# EAGLE design circuit (EAGLE 7.1.0)
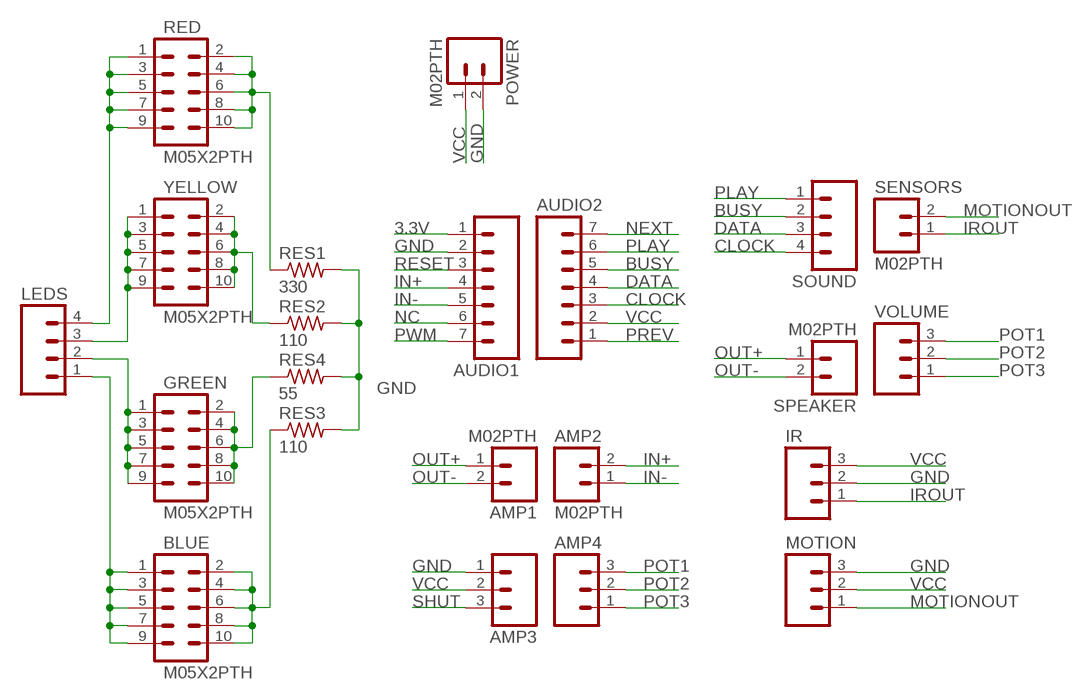
[diagram p0: schematic, sheet 1]

## Parts
AMP1  M02PTH  [1X02]
AMP2  M02PTH  [1X02]
AMP3  M03PTH  [1X03]
AMP4  M03PTH  [1X03]
AUDIO1  M07  [1X07]
AUDIO2  M07  [1X07]
BLUE  M05X2PTH  [AVR_ICSP]
GREEN  M05X2PTH  [AVR_ICSP]
IR  M03PTH  [1X03]
LEDS  M04PTH  [1X04]
MOTION  M03PTH  [1X03]
POWER  M02PTH  [1X02]
RED  M05X2PTH  [AVR_ICSP]
RES1  330  R-US_0204/2V  [0204V]
RES2  110  R-US_0204/2V  [0204V]
RES3  110  R-US_0204/2V  [0204V]
RES4  55  R-US_0204/2V  [0204V]
SENSORS  M02PTH  [1X02]
SOUND  M04PTH  [1X04]
SPEAKER  M02PTH  [1X02]
VOLUME  M03PTH  [1X03]
YELLOW  M05X2PTH  [AVR_ICSP]

## Nets
3.3V: AUDIO1.1
BUSY: AUDIO2.5 SOUND.2
CLOCK: AUDIO2.3 SOUND.4
DATA: AUDIO2.4 SOUND.3
GND: AMP3.1 AUDIO1.2 IR.2 MOTION.3 POWER.2 RES1.2 RES2.2 RES3.2 RES4.2
IN+: AMP2.2 AUDIO1.4
IN-: AMP2.1 AUDIO1.5
IROUT: IR.1 SENSORS.1
MOTIONOUT: MOTION.1 SENSORS.2
N$1: LEDS.4 RED.1 RED.3 RED.5 RED.7 RED.9
N$2: LEDS.3 YELLOW.1 YELLOW.3 YELLOW.5 YELLOW.7 YELLOW.9
N$3: GREEN.1 GREEN.3 GREEN.5 GREEN.7 GREEN.9 LEDS.2
N$4: BLUE.1 BLUE.3 BLUE.5 BLUE.7 BLUE.9 LEDS.1
N$5: RED.2 RED.4 RED.6 RED.8 RED.10 RES1.1
N$6: RES2.1 YELLOW.2 YELLOW.4 YELLOW.6 YELLOW.8 YELLOW.10
N$8: GREEN.2 GREEN.4 GREEN.6 GREEN.8 GREEN.10 RES4.1
N$9: BLUE.2 BLUE.4 BLUE.6 BLUE.8 BLUE.10 RES3.1
NC: AUDIO1.6
NEXT: AUDIO2.7
OUT+: AMP1.1 SPEAKER.1
OUT-: AMP1.2 SPEAKER.2
PLAY: AUDIO2.6 SOUND.1
POT1: AMP4.3 VOLUME.3
POT2: AMP4.2 VOLUME.2
POT3: AMP4.1 VOLUME.1
PREV: AUDIO2.1
PWM: AUDIO1.7
RESET: AUDIO1.3
SHUT: AMP3.3
VCC: AMP3.2 AUDIO2.2 IR.3 MOTION.2 POWER.1

## Library data of the parts
AMP1 AMP2 POWER SENSORS SPEAKER = SparkFun-Connectors:M02: Standard 2-pin 0.1" header. Use with - straight break away headers ( PRT-00116) - right angle break away headers (PRT-00553) - swiss pins (PRT-00743) - machine pins (PRT-00117) - female headers (PRT-00115) Molex polarized connector foot print use with: PRT-08233 with associated crimp pins and housings. 2.54_SCREWTERM for use with PRT-10571. 3.5mm Screw Terminal footprints for PRT-08084 5mm Screw Terminal footprints for use with PRT-08432
AMP3 AMP4 IR MOTION VOLUME = SparkFun-Connectors:M03: Header 3 Standard 3-pin 0.1" header. Use with straight break away headers (SKU : PRT-00116), right angle break away headers (PRT-00553), swiss pins (PRT-00743), machine pins (PRT-00117), and female headers (PRT-00115). Molex polarized connector foot print use with SKU : PRT-08232 with associated crimp pins and housings.
AUDIO1 AUDIO2 = SparkFun-Connectors:M07: Header 7 Standard 7-pin 0.1" header. Use with straight break away headers (SKU : PRT-00116), right angle break away headers (PRT-00553), swiss pins (PRT-00743), machine pins (PRT-00117), and female headers (PRT-00115). NOTES ON THE VARIANTS LOCK and LOCK_LONGPADS... This footprint was designed to help hold the alignment of a through-hole component (i.e. 7-pin header) while soldering it into place. You may notice that each hole has been shifted either up or down by 0.005 of an inch from it's more standard position (which is usually a perfectly straight line). This slight alteration caused the pins (the squares in the middle) to touch the edges of the holes. Because they are alternating, it causes a "brace" to hold the header in place. 0.005 has proven to be the perfect amount of "off-center" position when using our standard breakaway headers. Although looks a little odd when you look at the bare footprint, once you have a header in there, the alteration is very hard to notice. Also, if you push a header all the way into place, it is covered up entirely on the bottom side. This idea of altering the position of holes to aid alignment will be further integrated into the Sparkfun Library for other footprints. It can help hold any component with 3 or more connection pins.
BLUE GREEN RED YELLOW = SparkFun-Connectors:M05X2: Header 5x2 Standard 10-pin dual row 0.1" header. Commonly used with AVR-ISP. Use with Spark Fun Electronics SKU: PRT-00778
LEDS SOUND = SparkFun-Connectors:M04: Header 4 Standard 4-pin 0.1" header. Use with straight break away headers (SKU : PRT-00116), right angle break away headers (PRT-00553), swiss pins (PRT-00743), machine pins (PRT-00117), and female headers (PRT-00115). Molex polarized connector foot print use with SKU : PRT-08231 with associated crimp pins and housings. 1MM SMD Version SKU: PRT-10208
RES1-RES4 = rcl:R-US_: RESISTOR, American symbol

## Board
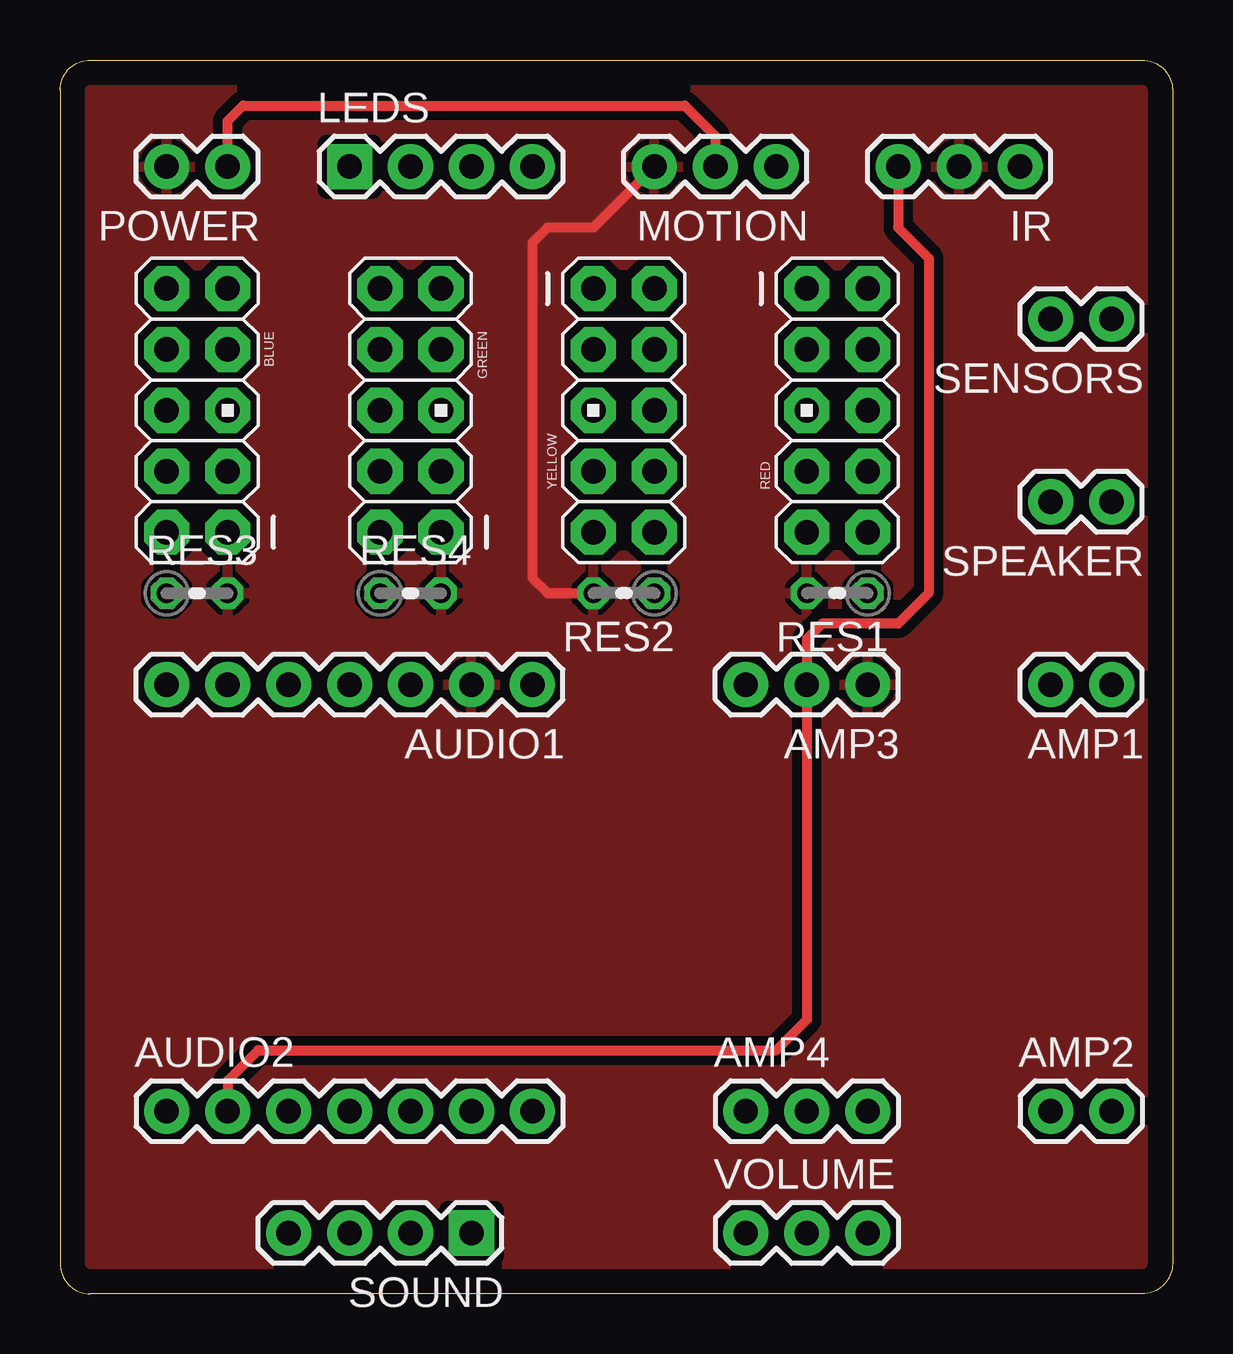
[diagram p1: board, top side]
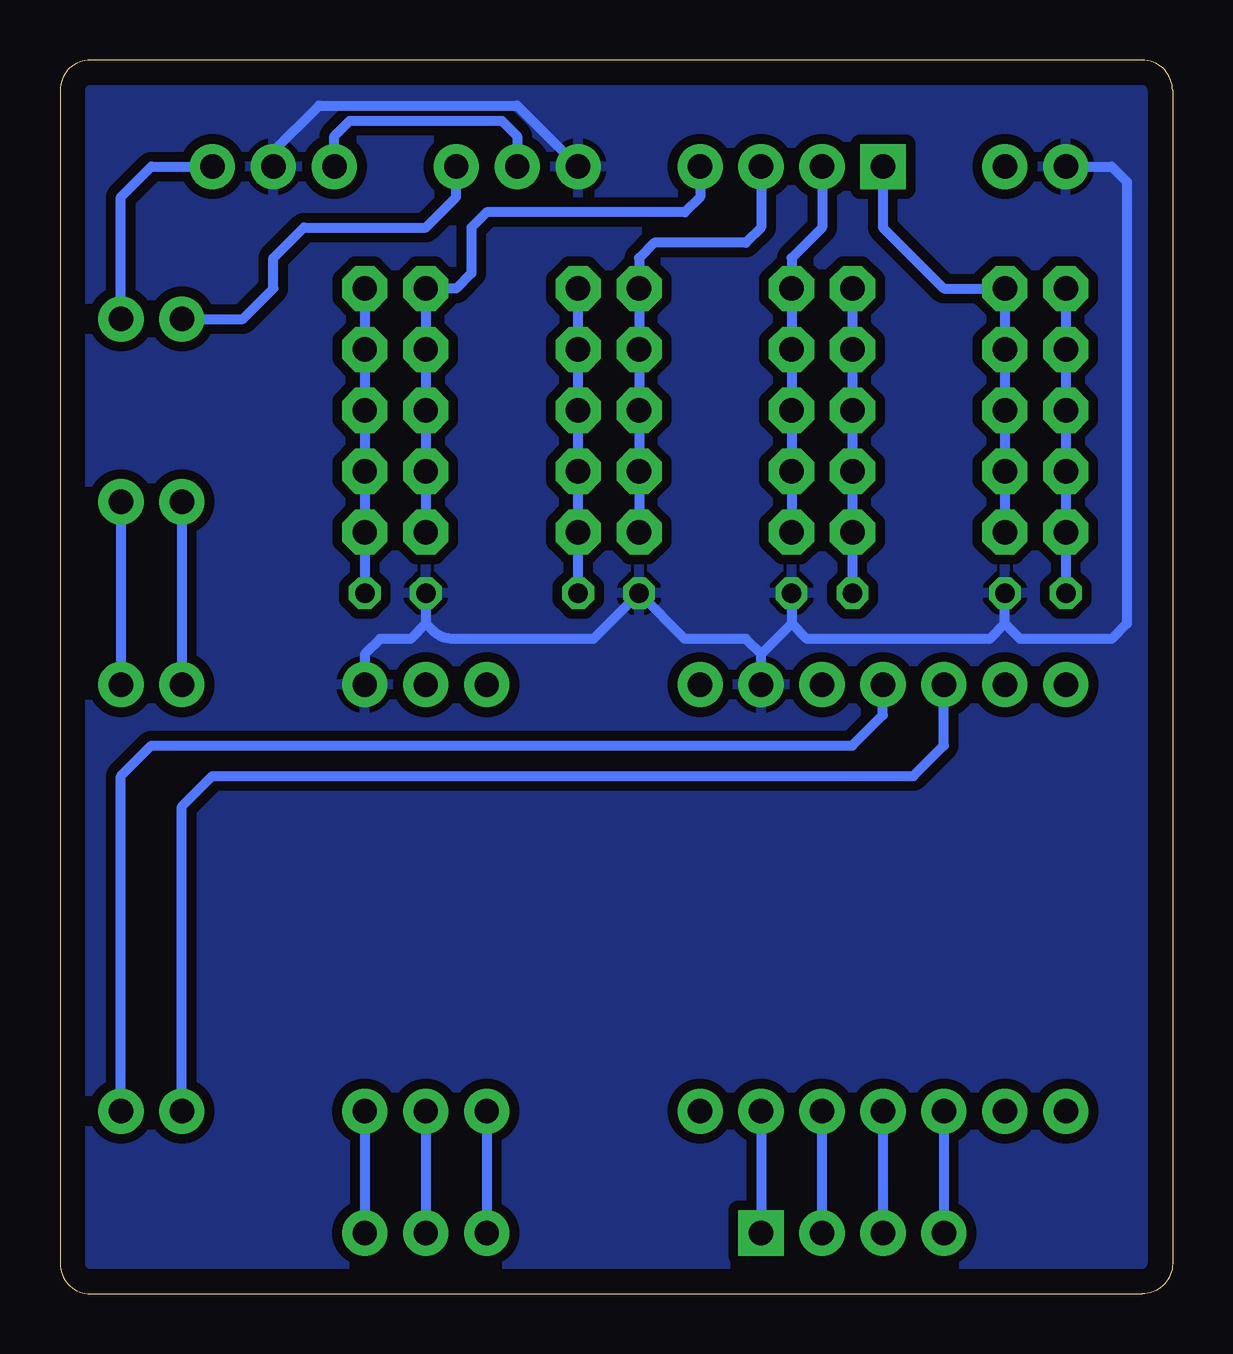
[diagram p2: board, bottom side, seen from below]

Size 46.35 x 51.43 mm. Coordinates in mm from the lower left corner, seen from the top.
Outline: 0,50.16 0,1.27 arc90 1.27,0 45.09,0 arc90 46.35,1.27 46.35,50.16 arc90 45.09,51.43 1.27,51.43 arc90 0,50.16
Copper layers (1*16): Top 0.035mm / dielectric 1.5mm / Bottom 0.035mm
Design rules "default": minimum track width 10mil, minimum drill 24mil, track to track 8mil, track to pad 8mil, pad to pad 8mil, via to via 8mil, smd to smd 8mil, copper to edge 40mil, drill to drill 8mil, minimum pad ring 10mil, minimum via ring 8mil, stop-mask expansion 4mil, vias tented up to drill 0mil, thermal gap 10mil

### Footprints (pad centres in the part's own frame; a part is rotated, then mirrored left to right if it is on the bottom)
1X02 = drill 1.016 pad 1.88: 1 0,0; 2 2.54,0
1X03 = drill 1.016 pad 1.88: 1 0,0; 2 2.54,0; 3 5.08,0
1X07 = drill 1.016 pad 1.88: 1 0,0; 2 2.54,0; 3 5.08,0; 4 7.62,0; 5 10.16,0; 6 12.7,0; 7 15.24,0
AVR_ICSP = drill 1.016 pad 1.88 octagon: 1 -1.27,5.08; 2 1.27,5.08; 3 -1.27,2.54; 4 1.27,2.54; 5 -1.27,0; 6 1.27,0; 7 -1.27,-2.54; 8 1.27,-2.54; 9 -1.27,-5.08; 10 1.27,-5.08
1X04 = drill 1.016 pad 1.88 square: 1 0,0 | drill 1.016 pad 1.88: 2 2.54,0; 3 5.08,0; 4 7.62,0
0204V = drill 0.813 octagon: 1 -1.27,0; 2 1.27,0

### Placement (x,y rotation side)
AMP1  43.81,25.4 180 top
AMP2  41.27,7.62 0 top
AMP3  33.66,25.4 180 top
AMP4  28.58,7.62 0 top
AUDIO1  19.69,25.4 180 top
AUDIO2  4.45,7.62 0 top
BLUE  5.71,36.83 180 top
GREEN  14.61,36.83 180 top
IR  40,46.99 180 top
LEDS  12.06,46.99 0 top
MOTION  29.85,46.99 180 top
POWER  6.98,46.99 180 top
RED  32.38,36.83 0 top
RES1  32.38,29.21 180 top
RES2  23.5,29.21 180 top
RES3  5.71,29.21 0 top
RES4  14.61,29.21 0 top
SENSORS  43.81,40.64 180 top
SOUND  17.15,2.54 180 top
SPEAKER  43.81,33.02 180 top
VOLUME  28.58,2.54 0 top
YELLOW  23.5,36.83 0 top

### Tracks (layer width: path | path; a pad name or v marks a point on that pad's centre or on a via)
BUSY
  Bottom 0.406: SOUND.2 AUDIO2.5
CLOCK
  Bottom 0.406: AUDIO2.3 SOUND.4
DATA
  Bottom 0.406: AUDIO2.4 SOUND.3
GND
  Top 0.406: MOTION.3 22.23,44.45 20.32,44.45 19.69,43.82 19.69,29.84 20.32,29.21 RES2.2
  Bottom 0.406: 31.12,27.94 31.75,27.3 33.02,27.3 33.66,26.67 AMP3.1 | AUDIO1.2 17.15,26.67 | 6.98,27.94 7.62,27.3 15.24,27.3 15.88,27.94 | 17.15,26.67 17.78,27.3 20.32,27.3 RES2.2 24.13,27.3 29.95,27.3 arc45 30.85,27.68 31.12,27.94 | POWER.2 2.54,46.99 1.91,46.35 1.91,27.94 2.54,27.3 6.35,27.3 6.98,27.94 | IR.2 37.46,47.62 35.56,49.53 27.31,49.53 MOTION.3 | 6.98,27.94 RES3.2 | RES4.2 15.88,27.94 | 15.88,27.94 17.15,26.67 | RES1.2 31.12,27.94
  pour Top (isolate 0.406): -2.54,55.24 44.56,55.24 arc-45 45.46,54.87 51.43,48.9 51.43,3.07 arc-45 51.06,2.17 47.62,-1.27 1.16,-1.27 arc-45 0.26,-0.9 -3.81,3.17 -3.81,53.45 arc-45 -3.44,54.35
  pour Bottom (isolate 0.406): -3.81,54.61 -3.81,1.8 arc45 -3.44,0.9 -1.91,-0.64 45.83,-0.64 arc45 46.73,-0.26 49.53,2.54 49.53,51.54 arc45 49.16,52.44 46.99,54.61
IN+
  Bottom 0.406: AMP2.2 43.81,21.59 42.54,22.86 13.33,22.86 12.06,24.13 AUDIO1.4
IN-
  Bottom 0.406: AMP2.1 41.27,20.32 40,21.59 10.79,21.59 9.53,22.86 AUDIO1.5
IROUT
  Bottom 0.406: SENSORS.1 43.81,45.72 42.54,46.99 IR.1
MOTIONOUT
  Bottom 0.406: SENSORS.2 38.73,40.64 37.46,41.91 37.46,43.18 36.2,44.45 31.12,44.45 29.85,45.72 MOTION.1
N$1
  Bottom 0.406: RED.9 RED.7 RED.5 RED.3 RED.1 29.85,41.91 29.21,42.54 29.21,44.45 28.58,45.09 20.32,45.09 19.69,45.72 LEDS.4
N$2
  Bottom 0.406: LEDS.3 17.15,44.45 17.78,43.82 21.59,43.82 22.23,43.18 YELLOW.1 YELLOW.3 YELLOW.5 YELLOW.7 YELLOW.9
N$3
  Bottom 0.406: LEDS.2 14.61,44.45 15.88,43.18 GREEN.9 GREEN.7 GREEN.5 GREEN.3 GREEN.1
N$4
  Bottom 0.406: LEDS.1 12.06,44.45 9.53,41.91 BLUE.9 BLUE.7 BLUE.5 BLUE.3 BLUE.1
N$5
  Bottom 0.406: RED.2 RED.4 RED.6 RED.8 RED.10 RES1.1
N$6
  Bottom 0.406: YELLOW.2 YELLOW.4 YELLOW.6 YELLOW.8 YELLOW.10 RES2.1
N$8
  Bottom 0.406: GREEN.10 GREEN.8 GREEN.6 GREEN.4 GREEN.2 RES4.1
N$9
  Bottom 0.406: BLUE.10 BLUE.8 BLUE.6 BLUE.4 BLUE.2 RES3.1
OUT+
  Bottom 0.406: SPEAKER.1 AMP1.1
OUT-
  Bottom 0.406: SPEAKER.2 AMP1.2
PLAY
  Bottom 0.406: AUDIO2.6 SOUND.1
POT1
  Bottom 0.406: AMP4.3 VOLUME.3
POT2
  Bottom 0.406: AMP4.2 VOLUME.2
POT3
  Bottom 0.406: AMP4.1 VOLUME.1
VCC
  Top 0.406: AUDIO2.2 6.98,8.89 8.26,10.16 29.85,10.16 31.12,11.43 AMP3.2 31.12,27.3 31.75,27.94 34.92,27.94 36.2,29.21 36.2,43.18 34.92,44.45 IR.3 | POWER.1 6.98,48.9 7.62,49.53 26.04,49.53 27.31,48.26 MOTION.2
  Bottom 0.406: IR.3 34.92,48.26 34.29,48.9 27.94,48.9 27.31,48.26 MOTION.2